# EAGLE schematic enclosure_controller_esp32 (EAGLE 9.6.2)
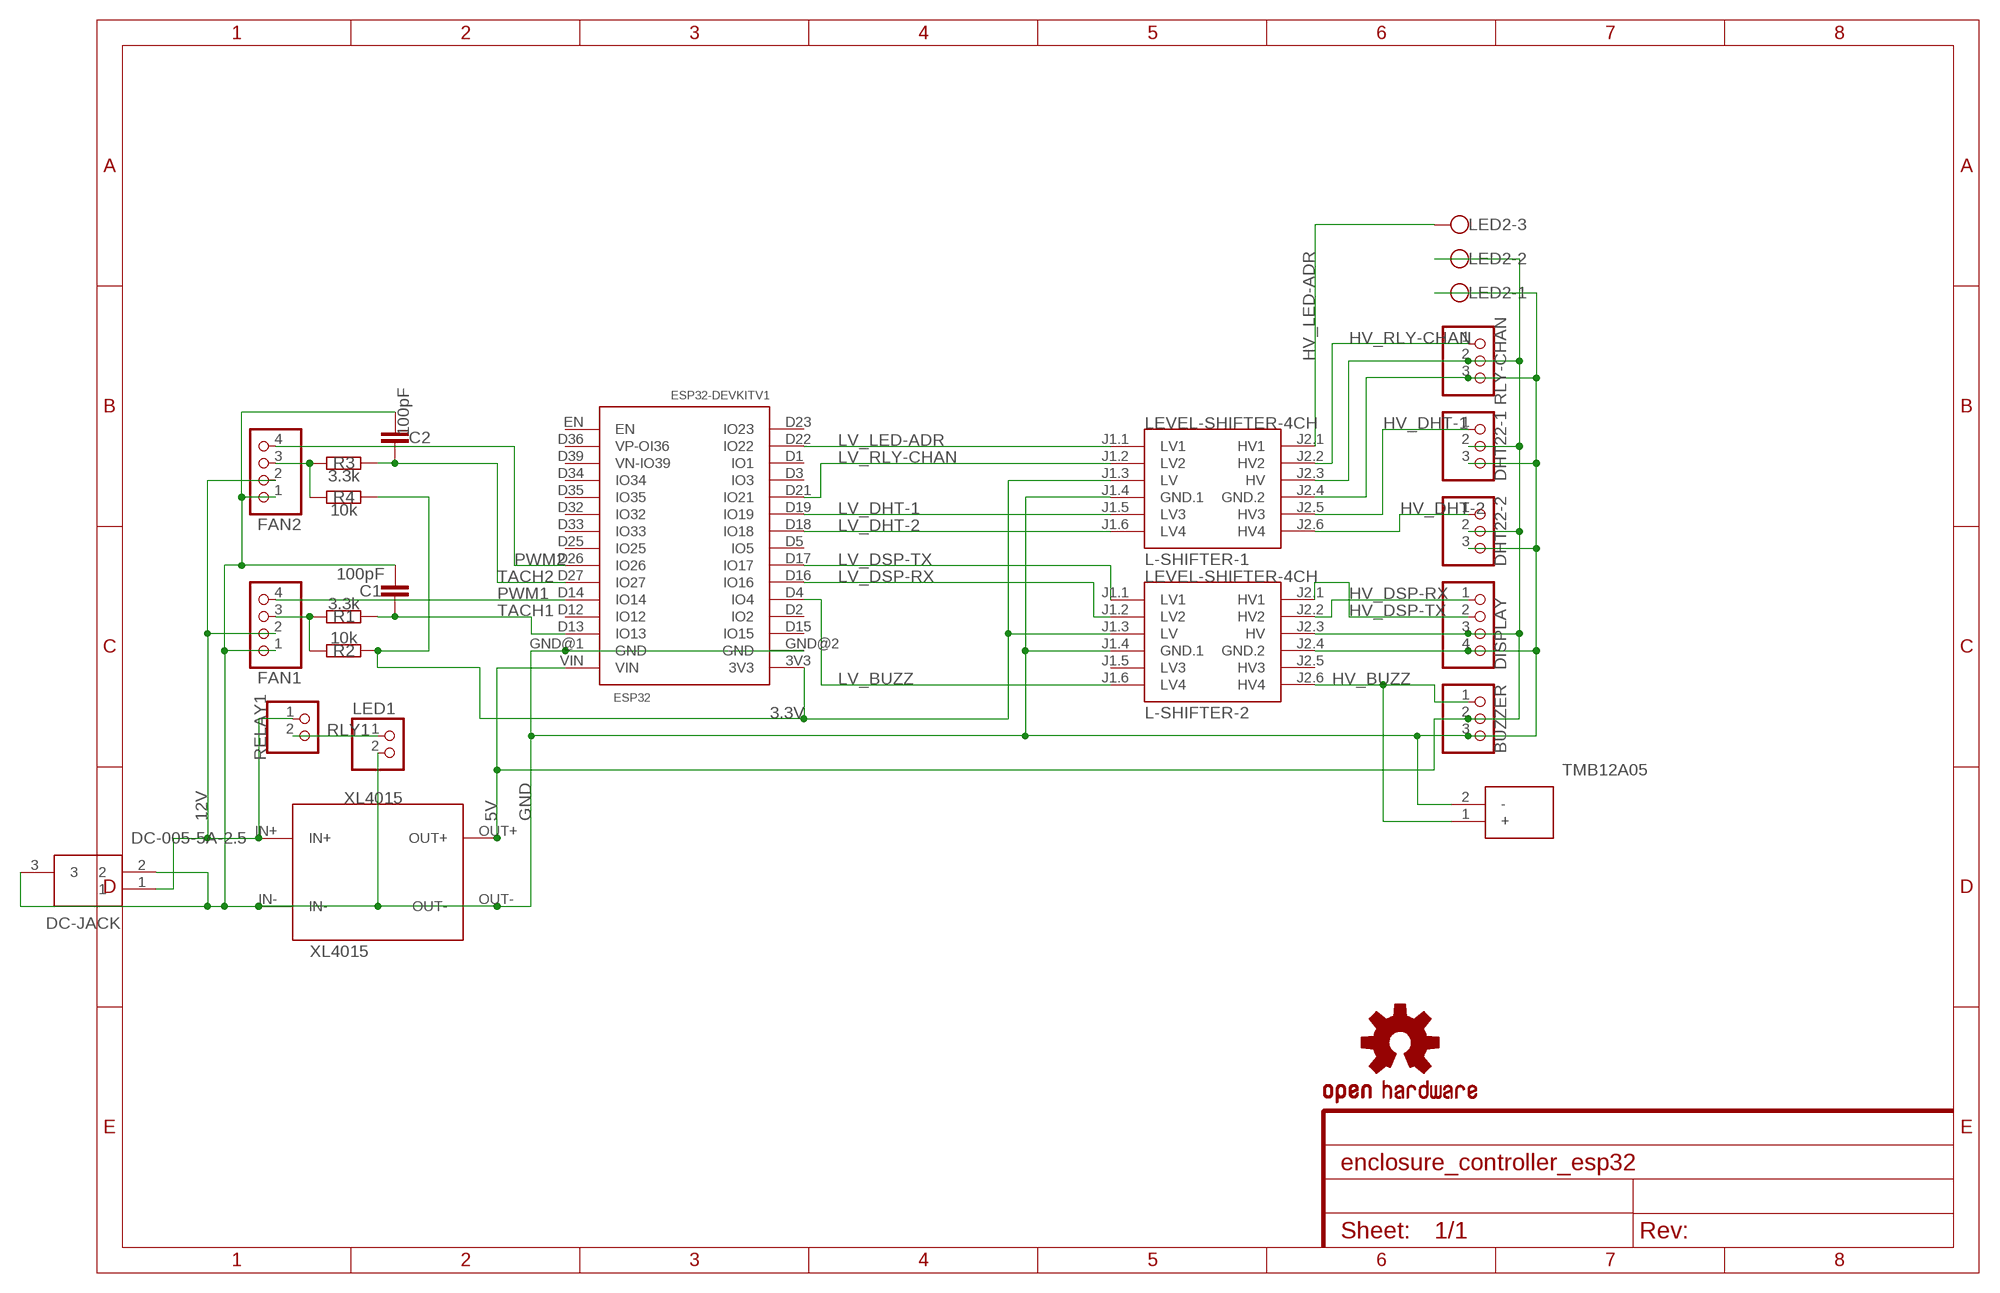
[diagram p0: schematic, sheet 1]

## Parts
BUZZER  PINHD-1X3/OCT  [1X03/OCT]
C1  100pF  C-EU050-025X075  [C050-025X075]
C2  100pF  C-EU050-025X075  [C050-025X075]
DC-JACK  DC-005-5A-2.5  [DC0055A25]
DHT22-1  PINHD-1X3/OCT  [1X03/OCT]
DHT22-2  PINHD-1X3/OCT  [1X03/OCT]
DISPLAY  PINHD-1X4/OCT  [1X04/OCT]
ESP32  ESP32DEVKITV1  [ESP32-DEVKITV1]
FAN1  PINHD-1X4/OCT  [1X04/OCT]
FAN2  PINHD-1X4/OCT  [1X04/OCT]
L-SHIFTER-1  LEVEL-SHIFTER-4CH  [LEVEL-SHIFTER-4CH]
L-SHIFTER-2  LEVEL-SHIFTER-4CH  [LEVEL-SHIFTER-4CH]
LED1  PINHD-1X2/OCT  [1X02/OCT]
LED2  LED2-ADR  W237-103  [W237-103]
LOGO1  OSHW-LOGOM  [OSHW-LOGO-M]
LS1  TMB12A05  [TMB12A05]
R1  3.3k  R-EU_0207/10  [0207/10]
R2  10k  R-EU_0207/10  [0207/10]
R3  3.3k  R-EU_0207/10  [0207/10]
R4  10k  R-EU_0207/10  [0207/10]
RELAY1  PINHD-1X2/OCT  [1X02/OCT]
RLY-CHAN  PINHD-1X3/OCT  [1X03/OCT]
XL4015  XL4015  [XL4015]

## Nets
3.3V: ESP32.3V3 L-SHIFTER-1.J1.3(LV) L-SHIFTER-2.J1.3(LV) R2.1 R4.1
5V [Power]: BUZZER.2 DHT22-1.2 DHT22-2.2 DISPLAY.3 ESP32.VIN L-SHIFTER-1.J2.3(HV) L-SHIFTER-2.J2.3(HV) LED2.2 RLY-CHAN.2 XL4015.OUT+
12V [Power]: DC-JACK.1 FAN1.2 FAN2.2 RELAY1.1 XL4015.IN+
GND: BUZZER.3 C1.2 C2.1 DC-JACK.2 DC-JACK.3 DHT22-1.3 DHT22-2.3 DISPLAY.4 ESP32.GND@1(GND) ESP32.GND@2(GND) FAN1.1 FAN2.1 L-SHIFTER-1.J1.4(GND.1) L-SHIFTER-1.J2.4(GND.2) L-SHIFTER-2.J1.4(GND.1) L-SHIFTER-2.J2.4(GND.2) LED1.2 LED2.1 LS1.2(-) RLY-CHAN.3 XL4015.IN- XL4015.OUT-
HV_BUZZ [signals]: BUZZER.1 L-SHIFTER-2.J2.6(HV4) LS1.1(+)
HV_DHT-1 [signals]: DHT22-1.1 L-SHIFTER-1.J2.5(HV3)
HV_DHT-2 [signals]: DHT22-2.1 L-SHIFTER-1.J2.6(HV4)
HV_DSP-RX [signals]: DISPLAY.1 L-SHIFTER-2.J2.2(HV2)
HV_DSP-TX [signals]: DISPLAY.2 L-SHIFTER-2.J2.1(HV1)
HV_LED-ADR [signals]: L-SHIFTER-1.J2.1(HV1) LED2.3
HV_RLY-CHAN [signals]: L-SHIFTER-1.J2.2(HV2) RLY-CHAN.1
LV_BUZZ [signals]: ESP32.D4(IO4) L-SHIFTER-2.J1.6(LV4)
LV_DHT-1 [signals]: ESP32.D19(IO19) L-SHIFTER-1.J1.5(LV3)
LV_DHT-2 [signals]: ESP32.D18(IO18) L-SHIFTER-1.J1.6(LV4)
LV_DSP-RX [signals]: ESP32.D16(IO16) L-SHIFTER-2.J1.2(LV2)
LV_DSP-TX [signals]: ESP32.D17(IO17) L-SHIFTER-2.J1.1(LV1)
LV_LED-ADR [signals]: ESP32.D22(IO22) L-SHIFTER-1.J1.1(LV1)
LV_RLY-CHAN [signals]: ESP32.D21(IO21) L-SHIFTER-1.J1.2(LV2)
PWM1: ESP32.D14(IO14) FAN1.4
PWM2: ESP32.D26(IO26) FAN2.4
RLY1: LED1.1 RELAY1.2
TACH1: C1.1 ESP32.D13(IO13) FAN1.3 R1.1 R1.2 R2.2
TACH2: C2.2 ESP32.D27(IO27) FAN2.3 R3.1 R3.2 R4.2
Unconnected: ESP32.D1(IO1) ESP32.D2(IO2) ESP32.D3(IO3) ESP32.D5(IO5) ESP32.D12(IO12) ESP32.D15(IO15) ESP32.D23(IO23) ESP32.D25(IO25) ESP32.D32(IO32) ESP32.D33(IO33) ESP32.D34(IO34) ESP32.D35(IO35) ESP32.D36(VP-OI36) ESP32.D39(VN-IO39) ESP32.EN L-SHIFTER-2.J1.5(LV3) L-SHIFTER-2.J2.5(HV3)

## Library data of the parts
BUZZER DHT22-1 DHT22-2 RLY-CHAN = pinhead_v2:PINHD-1X3: PIN HEADER
C1 C2 = rcl:C-EU: CAPACITOR, European symbol; SPICEPREFIX: C
DC-JACK = DC-005-5A-2.5:DC-005-5A-2.5: Power Connectors Through Hole RoHS Source: Datasheet <https://datasheet.lcsc.com/szlcsc/1903151807_XKB-Enterprise-DC-005-5A-2-5_C381115.pdf>; ARROW_PART_NUMBER: DC-005-5A-2.5; DESCRIPTION: Power Connectors Through Hole RoHS; HEIGHT: 11mm; MANUFACTURER_NAME: XKB Enterprise; MANUFACTURER_PART_NUMBER: DC-005-5A-2.5
DISPLAY FAN1 FAN2 = pinhead_v2:PINHD-1X4: PIN HEADER
ESP32 = ESP32-DEVKITV1:ESP32DEVKITV1
L-SHIFTER-1 L-SHIFTER-2 = diy-modules:LEVEL-SHIFTER-4CH: 4-Channel Bi-Directional Logic Level Converter based on BSS128 transistors Click here to find device on ebay.com <http://www.ebay.com/sch/i2c+logic+converter+module>
LED1 RELAY1 = pinhead_v2:PINHD-1X2: PIN HEADER
LED2 = con-wago-500_mod:W237-103: WAGO SCREW CLAMP; MPN: 237-103; OC_FARNELL: unknown; OC_NEWARK: 18M7116
LOGO1 = SparkFun-Aesthetics:OSHW-LOGO: Open-Source Hardware (OSHW) Logo This logo indicates the piece of hardware it is found on incorporates a OSHW license and/or adheres to the definition of open source hardware found here: http://freedomdefined.org/OSHW
LS1 = TMB12A05:TMB12A05: 12*9.5 Buzzers RoHS Source: Datasheet <https://datasheet.lcsc.com/szlcsc/Jiangsu-Huaneng-Elec-TMB12A05_C96093.pdf>; ARROW_PART_NUMBER: TMB12A05; DESCRIPTION: 12*9.5 Buzzers RoHS; HEIGHT: 9.5mm; MANUFACTURER_NAME: Jiangsu Huaneng Elec; MANUFACTURER_PART_NUMBER: TMB12A05
R1-R4 = rcl:R-EU_: RESISTOR, European symbol; SPICEPREFIX: R
XL4015 = XL4015:XL4015

## Net classes
0 default: width 0.4 mm, drill 0.025 mm, clearance 0.4 mm
1 Power: width 0.4 mm, drill 0.025 mm, clearance 0.4 mm
2 signals: width 0.4 mm, drill 1 mm, clearance 0.4 mm